# Altium project Mixed_Signal_Board_Project.PrjPcb (part 3 of 5)

## Sheet STM32F103 MCU.SchDoc
size A4; SheetNumber: 7; SheetTotal: 10
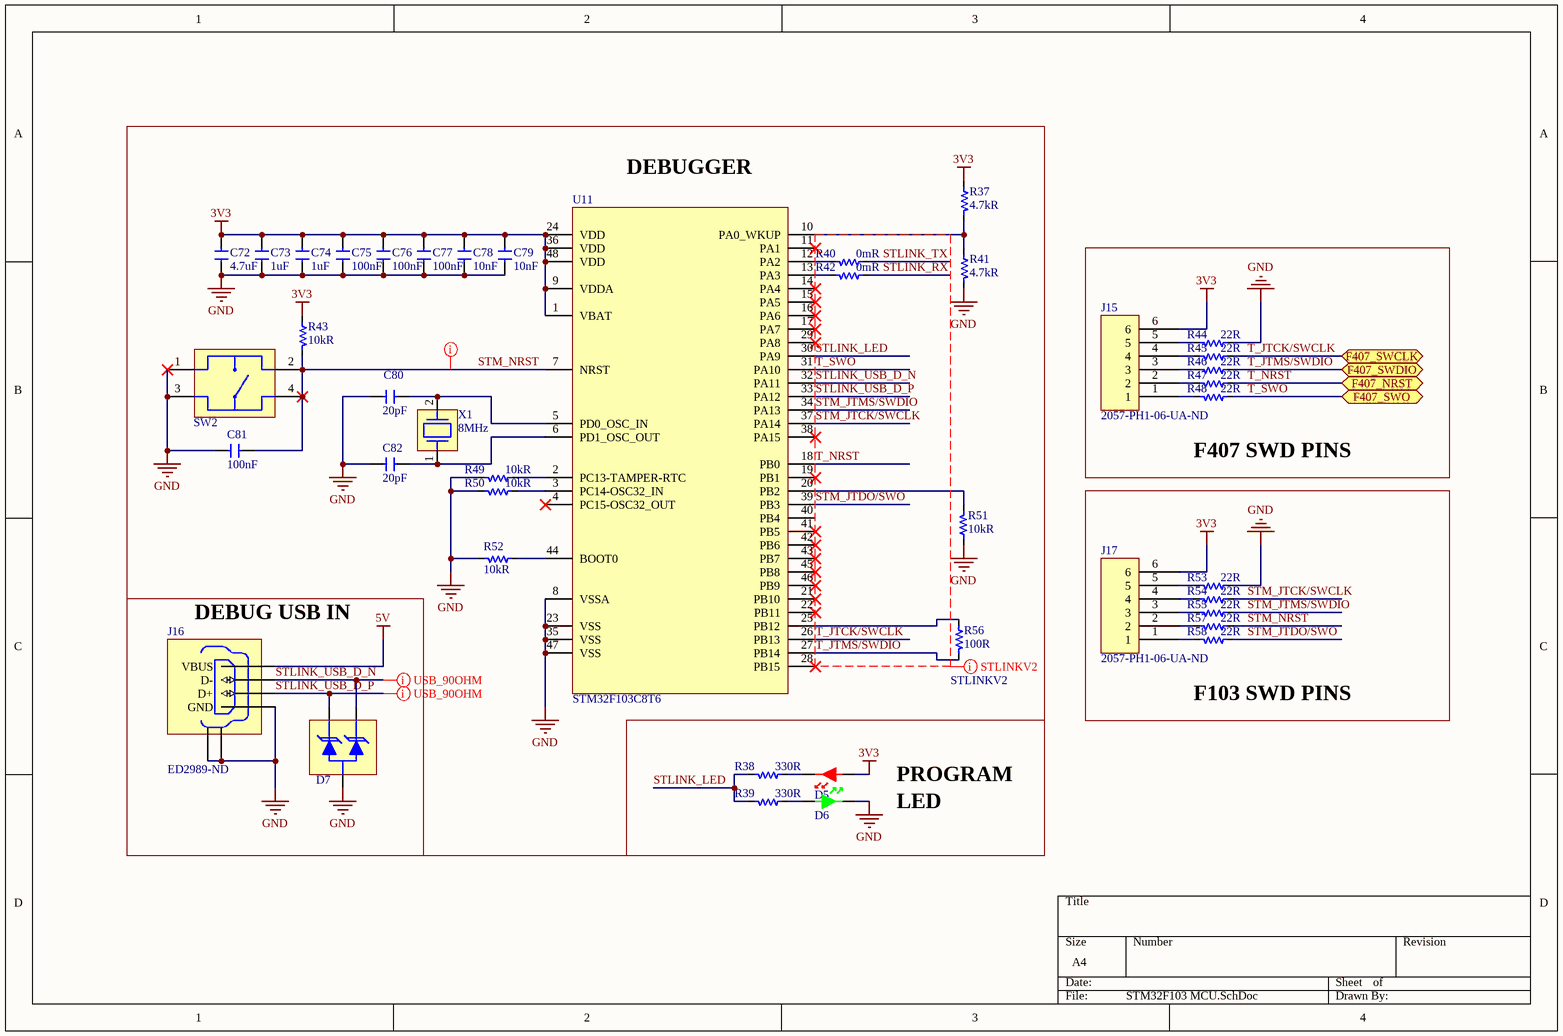
[diagram p6: STM32F103 MCU.SchDoc]

### Parts
C72  Capacitance: 4.7uF  [0805_CAP]  (hidden comment: CAP_4.7uF_%10_0805_25V_X7R_CER)
C73  1uF  [0805_CAP]
C74  1uF  [0805_CAP]
C75  Capacitance: 100nF  [0805_CAP]  (hidden comment: CAP_0.1uF_%20_50V_0805_X7R_CER)
C76  Capacitance: 100nF  [0805_CAP]  (hidden comment: CAP_0.1uF_%20_50V_0805_X7R_CER)
C77  Capacitance: 100nF  [0805_CAP]  (hidden comment: CAP_0.1uF_%20_50V_0805_X7R_CER)
C78  Capacitance: 10nF  [0805_CAP]  (hidden comment: CAP_10nF_%10_50V_0805_X7R_CER)
C79  Capacitance: 10nF  [0805_CAP]  (hidden comment: CAP_10nF_%10_50V_0805_X7R_CER)
C80  Capacitance: 20pF  [0805_CAP]  (hidden comment: CAP_20pF_5%_50V_0805_C0G/NP0_CER)
C81  Capacitance: 100nF  [0805_CAP]  (hidden comment: CAP_100nF_50V_0805_C0G_CER)
C82  Capacitance: 20pF  [0805_CAP]  (hidden comment: CAP_20pF_5%_50V_0805_C0G/NP0_CER)
D5  Red  [DIOC2114X07N-0805-LED-RED]  (value not drawn)
D6  Green  [DIOC2114X07N-0805-LED-GREEN]  (value not drawn)
D7  DIODE_TVS_3.3VWM_8VC_SOT23  [SOT170P237X110-3N]  (value not drawn)
J15  Supplier Part Number 1: 2057-PH1-06-UA-ND  [DIP_1X6_MALE_HEADER_2.54_PITCH]  (hidden comment: CONN_1X6_2.54m_Male Header)
J16  Supplier Part Number 1: ED2989-ND  [USB_2.0_B_OST_USB-A1HSW6]  (hidden comment: CONN_RCPT_USB-TYPE A_A1HSW6)
J17  Supplier Part Number 1: 2057-PH1-06-UA-ND  [DIP_1X6_MALE_HEADER_2.54_PITCH]  (hidden comment: CONN_1X6_2.54m_Male Header)
R37  Resistance: 4.7kR  [0805_RES]  (hidden comment: RES_4.7K OHM_5%_1/8W_0805)
R38  Resistance: 330R  [0805_RES]  (hidden comment: RES_330 OHM_5%_0805_1/8W)
R39  Resistance: 330R  [0805_RES]  (hidden comment: RES_330 OHM_5%_0805_1/8W)
R40  Resistance: 0mR  [0805_RES]  (hidden comment: RES_0 OHM_JUMPER_0805_1/8W)
R41  Resistance: 4.7kR  [0805_RES]  (hidden comment: RES_4.7K OHM_5%_1/8W_0805)
R42  Resistance: 0mR  [0805_RES]  (hidden comment: RES_0 OHM_JUMPER_0805_1/8W)
R43  Resistance: 10kR  [0805_RES]  (hidden comment: 10k Ohms)
R44  Resistance: 22R  [0805_RES]  (hidden comment: RES_22 OHM_1%_1/8W_0805)
R45  Resistance: 22R  [0805_RES]  (hidden comment: RES_22 OHM_1%_1/8W_0805)
R46  Resistance: 22R  [0805_RES]  (hidden comment: RES_22 OHM_1%_1/8W_0805)
R47  Resistance: 22R  [0805_RES]  (hidden comment: RES_22 OHM_1%_1/8W_0805)
R48  Resistance: 22R  [0805_RES]  (hidden comment: RES_22 OHM_1%_1/8W_0805)
R49  Resistance: 10kR  [0805_RES]  (hidden comment: 10k Ohms)
R50  Resistance: 10kR  [0805_RES]  (hidden comment: 10k Ohms)
R51  Resistance: 10kR  [0805_RES]  (hidden comment: 10k Ohms)
R52  Resistance: 10kR  [0805_RES]  (hidden comment: 10k Ohms)
R53  Resistance: 22R  [0805_RES]  (hidden comment: RES_22 OHM_1%_1/8W_0805)
R54  Resistance: 22R  [0805_RES]  (hidden comment: RES_22 OHM_1%_1/8W_0805)
R55  Resistance: 22R  [0805_RES]  (hidden comment: RES_22 OHM_1%_1/8W_0805)
R56  Resistance: 100R  [0805_RES]  (hidden comment: RES_100 OHM_1%_0805_1/8W)
R57  Resistance: 22R  [0805_RES]  (hidden comment: RES_22 OHM_1%_1/8W_0805)
R58  Resistance: 22R  [0805_RES]  (hidden comment: RES_22 OHM_1%_1/8W_0805)
SW2  SWITCH_TACTILE_SPST-NO_0.05A_12V  [TACT_SWITCH_6MMX6MM]  (value not drawn)
U11  STM32F103C8T6  [QFP50P900X900X160-48N]
X1  8MHz  [HC-49/US]

### Blocks framed on the sheet
F407 SWD PINS: J15 R44-R48
F103 SWD PINS: J17 R53-R55 R57 R58
DEBUG USB IN: D7 J16

### Ports
F407_NRST (bidir), F407_SWCLK (bidir), F407_SWDIO (bidir), F407_SWO (bidir)

### Nets
3V3: C72.2 C73.2 C74.2 C75.2 C76.2 C77.2 C78.2 C79.2 D5.2(ANODE) J15.6 J17.6 R37.2 R43.2 U11.1(VBAT) U11.9(VDDA) U11.24(VDD) U11.36(VDD) U11.48(VDD)
5V: J16.1(VBUS)
GND: C72.1 C73.1 C74.1 C75.1 C76.1 C77.1 C78.1 C79.1 C80.1 C81.2 C82.1 D6.1(CATHODE) D7.3(ANODE) J16.4(GND) J16.SH1(SHIELD) J16.SH2(SHIELD) R41.1 R44.2 R49.1 R50.1 R51.2 R52.1 R53.2 SW2.1 SW2.3 U11.8(VSSA) U11.23(VSS) U11.35(VSS) U11.47(VSS)
STLINK_LED: R38.1 R39.1 U11.30(PA9)
STLINK_RX: R42.2
STLINK_TX: R40.2
STLINK_USB_D_N: D7.1(CATHODE_1) J16.2(D-) U11.32(PA11)
STLINK_USB_D_P: D7.2(CATHODE_2) J16.3(D+) U11.33(PA12)
STM_JTCK/SWCLK: R54.2 U11.37(PA14)
STM_JTDO/SWO: R58.2 U11.39(PB3)
STM_JTMS/SWDIO: R55.2 U11.34(PA13)
STM_NRST: C81.1 R43.1 R57.2 SW2.2 SW2.4 U11.7(NRST)
T_JTCK/SWCLK: R45.2 U11.26(PB13) ; port F407_SWCLK
T_JTMS/SWDIO: R46.2 R56.1 U11.27(PB14) ; port F407_SWDIO
T_NRST: R47.2 U11.18(PB0) ; port F407_NRST
T_SWO: R48.2 U11.31(PA10) ; port F407_SWO
NetC80_2: C80.2 U11.5(PD0_OSC_IN) X1.2
NetC82_2: C82.2 U11.6(PD1_OSC_OUT) X1.1
NetD5_1: D5.1(CATHODE) R38.2
NetD6_2: D6.2(ANODE) R39.2
NetJ15_1: J15.1 R48.1
NetJ15_2: J15.2 R47.1
NetJ15_3: J15.3 R46.1
NetJ15_4: J15.4 R45.1
NetJ15_5: J15.5 R44.1
NetJ17_1: J17.1 R58.1
NetJ17_2: J17.2 R57.1
NetJ17_3: J17.3 R55.1
NetJ17_4: J17.4 R54.1
NetJ17_5: J17.5 R53.1
NetR37_1: R37.1 R41.2 U11.10(PA0_WKUP)
NetR40_1: R40.1 U11.12(PA2)
NetR42_1: R42.1 U11.13(PA3)
NetR49_2: R49.2 U11.2(PC13-TAMPER-RTC)
NetR50_2: R50.2 U11.3(PC14-OSC32_IN)
NetR51_1: R51.1 U11.20(PB2)
NetR52_2: R52.2 U11.44(BOOT0)
NetR56_2: R56.2 U11.25(PB12)

Not connected (* = marked no-connect by the designer): U11 4(PC15-OSC32_OUT)* 11(PA1)* 14(PA4)* 15(PA5)* 16(PA6)* 17(PA7)* 19(PB1)* 21(PB10)* 22(PB11)* 28(PB15)* 29(PA8)* 38(PA15)* 40(PB4) 41(PB5)* 42(PB6)* 43(PB7)* 45(PB8)* 46(PB9)*

### Layout directives
differential pair; differential pair class USB_90OHM: STLINK_USB_D_N, STLINK_USB_D_P
net class STLINKV2: STLINK_LED, STLINK_RX, STLINK_TX, STLINK_USB_D_N, STLINK_USB_D_P, STM_JTCK/SWCLK, STM_JTDO/SWO, STM_JTMS/SWDIO, STM_NRST, T_JTCK/SWCLK, T_JTMS/SWDIO, T_NRST, T_SWO

### Notes on the sheet
- DEBUGGER
- PROGRAM
- LED

### Library data of the parts
C72 = CAP_4.7uF_%10_0805_25V_X7R_CER: Cap 4.7UF 25VDC X7R 10% SMD 0805 Embossed Tape; Manufacturer: Murata; Manufacturer Part Number: GRM21BZ71E475KE15L; Supplier 1: Digi-Key; RoHS: Yes; Category: Ceramic Capacitors; Stock 1: 16381; Pricing 1: 1=0,35000, 10=0,24300, 50=0,16980, 100=0,14550, 500=0,10914, 1000=0,09217 (USD); RoHS Compliant: Yes; Supplier Part Number 1: 490-GRM21BZ71E475KE15LCT-ND
C73 C74 = CAP_1uF_%10_25V_0805_X7R_CER: 陶瓷电容 1uF(105) 1uF ±10% 25V 0805; Manufacturer: Samsung; Manufacturer Part Number: CL21B105KAFNNNG; Material: Ceramic; Dielectric: X7R; Supplier 1: Digi-Key; RoHS: Yes; Category: Ceramic Capacitors; Stock 1: 509034; Pricing 1: 1=0,10000, 10=0,07100, 50=0,03880, 100=0,03170, 500=0,02264, 1000=0,01779 (USD); Mount: Surface Mount; Case/Package: 0805; Case Code (Metric): 2012; Case Code (Imperial): 0805; Min Operating Temperature: -55°C; Max Operating Temperature: 125°C; Tolerance: 10%; Capacitance: 1uF; Voltage Rating: 25V; Package Quantity: 3000; Packaging: Tape and Reel; Voltage: 25V; Series: CL; Length: 2mm; Width: 0.049inch; Height: 1.25mm; Thickness: 0.053inch; Depth: 1.25mm; Radiation Hardening: No; RoHS Compliant: Yes; ComponentLink1URL: https://datasheet.ciiva.com/26920/getdatasheetpartid-698495-26920200.pdf?src-supplier=Verical; ComponentLink1Description: https://datasheet.ciiva.com/26920/getdatasheetpartid-698495-26920200.pdf?src-supplier=Verical; ComponentLink2URL: https://datasheet.ciiva.com/29199/455911-da-01-en-vs-kondensator-0805-29199043.pdf?src-supplier=Conrad; ComponentLink2Description: https://datasheet.ciiva.com/29199/455911-da-01-en-vs-kondensator-0805-29199043.pdf?src-supplier=Conrad; ComponentLink3URL: https://datasheet.ciiva.com/16428/cl05b104kq5nnnc-16428871.pdf?src-supplier=Future+Electronics; ComponentLink3Description: https://datasheet.ciiva.com/16428/cl05b104kq5nnnc-16428871.pdf?src-supplier=Future+Electronics; Supplier Part Number 1: 1276-6469-1-ND
C75-C77 = CAP_0.1uF_%20_50V_0805_X7R_CER: Cap Ceramic 0.1uF 50V X7R 20% SMD 0805 125C Paper T/R; Manufacturer: KEMET; Manufacturer Part Number: C0805C104M5RACTU; Supplier 1: Digi-Key; RoHS: Yes; Category: Ceramic Capacitors; Stock 1: 4863; Pricing 1: 1=0,10000, 10=0,06400, 50=0,03500, 100=0,02860, 500=0,02040, 1000=0,01603 (USD); Mount: Surface Mount; Case/Package: 0805; Dielectric Material: Ceramic; Min Operating Temperature: -55°C; Max Operating Temperature: 125°C; Tolerance: 20%; Dielectric: X7R; Packaging: Tape and Reel; Voltage Rating (DC): 50V; Length: 2mm; Height: 0.9mm; Depth: 1.25mm; Radiation Hardening: No; ComponentLink1URL: http://uk.rs-online.com/webdocs/13da/0900766b813daa06.pdf?src-supplier=RSComponents; ComponentLink1Description: http://uk.rs-online.com/webdocs/13da/0900766b813daa06.pdf?src-supplier=RSComponents; ComponentLink2URL: https://www.verical.com/server-webapp/html/getDatasheet?partID=774625&src-supplier=Verical; ComponentLink2Description: https://www.verical.com/server-webapp/html/getDatasheet?partID=774625&src-supplier=Verical; ComponentLink3URL: http://www.farnell.com/datasheets/2739857.pdf?src-supplier=Farnell; ComponentLink3Description: http://www.farnell.com/datasheets/2739857.pdf?src-supplier=Farnell; ComponentLink4URL: http://uk.rs-online.com/webdocs/1515/0900766b81515223.pdf?src-supplier=RSComponents; ComponentLink4Description: http://uk.rs-online.com/webdocs/1515/0900766b81515223.pdf?src-supplier=RSComponents; ComponentLink5URL: http://components.arrow.com/part/dataview/0323_00324812?src-supplier=Arrow+Europe; ComponentLink5Description: http://components.arrow.com/part/dataview/0323_00324812?src-supplier=Arrow+Europe; ComponentLink6URL: http://uk.rs-online.com/webdocs/1528/0900766b81528e2f.pdf?src-supplier=RSComponents; ComponentLink6Description: http://uk.rs-online.com/webdocs/1528/0900766b81528e2f.pdf?src-supplier=RSComponents; ComponentLink7URL: http://www.farnell.com/datasheets/2739857.pdf?src-supplier=Newark; ComponentLink7Description: http://www.farnell.com/datasheets/2739857.pdf?src-supplier=Newark; ComponentLink8URL: http://www.alliedelec.com/m/d/9bfe7773041ffe9d406e68bc7b377fdd.pdf?src-supplier=Allied+Electronics; ComponentLink8Description: http://www.alliedelec.com/m/d/9bfe7773041ffe9d406e68bc7b377fdd.pdf?src-supplier=Allied+Electronics; ComponentLink9URL: https://api.kemet.com/component-edge/download/datasheet/C0805C104M5RACTU.pdf?src-supplier=Digi-Key; ComponentLink9Description: https://api.kemet.com/component-edge/download/datasheet/C0805C104M5RACTU.pdf?src-supplier=Digi-Key; ComponentLink10URL: http://capacitoredge.kemet.com/capedge2/DataSheet?pn=C0805C104M5RACTU&src-supplier=Avnet+Europe; ComponentLink10Description: http://capacitoredge.kemet.com/capedge2/DataSheet?pn=C0805C104M5RACTU&src-supplier=Avnet+Europe; ComponentLink11URL: http://www.farnell.com/datasheets/2739857.pdf?src-supplier=Element14; ComponentLink11Description: http://www.farnell.com/datasheets/2739857.pdf?src-supplier=Element14; ComponentLink12URL: http://www.mouser.com/ds/2/212/KEM_C1002_X7R_SMD-1102033.pdf?src-supplier=Mouser; ComponentLink12Description: http://www.mouser.com/ds/2/212/KEM_C1002_X7R_SMD-1102033.pdf?src-supplier=Mouser; ComponentLink13URL: https://www.verical.com/server-webapp/html/getDatasheet?partID=91523&src-supplier=Verical; ComponentLink13Description: https://www.verical.com/server-webapp/html/getDatasheet?partID=91523&src-supplier=Verical; ComponentLink14URL: http://components.arrow.com/part/dataview/2091108S8109171N7429?src-supplier=Arrow+Electronics; ComponentLink14Description: http://components.arrow.com/part/dataview/2091108S8109171N7429?src-supplier=Arrow+Electronics; Supplier Part Number 1: 399-C0805C104M5RAC7800CT-ND
C78 C79 = CAP_10nF_%10_50V_0805_X7R_CER: CAP CER 10000PF 50V X7R 0805; Manufacturer: Samsung; Manufacturer Part Number: CL21B103KBANNNC; Material: Ceramic; Tolerance: 10%; Supplier 1: Digi-Key; RoHS: Yes; Category: Ceramic Capacitors; Stock 1: 1431273; Pricing 1: 1=0,10000, 10=0,04600, 50=0,02500, 100=0,02050, 500=0,01464, 1000=0,01150 (USD); Mount: Surface Mount; Case/Package: 0805; Case Code (Metric): 2012; Case Code (Imperial): 0805; Contact Plating: Tin; Min Operating Temperature: -55°C; Max Operating Temperature: 125°C; Dielectric: X7R; Voltage: 50V; Voltage Rating (DC): 50V; Packaging: Tape and Reel; Voltage Rating: 50V; Series: CL; Construction: Flat; Length: 2mm; Width: 0.049inch; Height: 0.65mm; Depth: 1.25mm; Thickness: 0.03inch; Radiation Hardening: No; Lead Free: Lead Free; RoHS Compliant: Yes; ComponentLink1URL: https://datasheet.ciiva.com/25709/cl21b103kbannnc-25709781.pdf?src-supplier=Digi-Key; ComponentLink1Description: https://datasheet.ciiva.com/25709/cl21b103kbannnc-25709781.pdf?src-supplier=Digi-Key; ComponentLink2URL: https://datasheet.ciiva.com/29199/455082-da-01-en-vs-kondensator-0805-29199459.pdf?src-supplier=Conrad; ComponentLink2Description: https://datasheet.ciiva.com/29199/455082-da-01-en-vs-kondensator-0805-29199459.pdf?src-supplier=Conrad; Supplier Part Number 1: 1276-1015-1-ND
C80 C82 = CAP_20pF_5%_50V_0805_C0G/NP0_CER: CAP CER 20PF 50V C0G/NP0 0805; Manufacturer: Samsung; Manufacturer Part Number: CL21C200JBANNNC; Tolerance: 5%; Dielectric: C0G; Temperature Coefficient: 300ppm/°C; Supplier 1: Digi-Key; RoHS: Yes; Category: Ceramic Capacitors; Stock 1: 11381; Pricing 1: 1=0,10000, 10=0,04700, 50=0,02540, 100=0,02080, 500=0,01484, 1000=0,01166 (USD); Mount: Surface Mount; Case/Package: 0805; Case Code (Metric): 2012; Case Code (Imperial): 0805; Min Operating Temperature: -55°C; Max Operating Temperature: 125°C; Voltage Rating: 50V; Package Quantity: 1; Packaging: Tape and Reel; Voltage: 50V; Series: CL; Construction: Flat; Length: 2mm; Width: 0.049inch; Height: 0.65mm; Thickness: 0.03inch; Depth: 1.25mm; Radiation Hardening: No; RoHS Compliant: Yes; ComponentLink1URL: https://datasheet.ciiva.com/16428/cl21c200jbannnc-16428913.pdf?src-supplier=Future+Electronics; ComponentLink1Description: https://datasheet.ciiva.com/16428/cl21c200jbannnc-16428913.pdf?src-supplier=Future+Electronics; Supplier Part Number 1: 1276-1829-1-ND
C81 = CAP_100nF_50V_0805_C0G_CER: Cap Ceramic 0.1uF 50V X7R 20% SMD 0805 125C Paper T/R; Manufacturer: KEMET; Manufacturer Part Number: C0805C104M5RACTU; Supplier 1: Digi-Key; RoHS: Yes; Category: Ceramic Capacitors; Stock 1: 4863; Pricing 1: 1=0,10000, 10=0,06400, 50=0,03500, 100=0,02860, 500=0,02040, 1000=0,01603 (USD); Mount: Surface Mount; Case/Package: 0805; Dielectric Material: Ceramic; Min Operating Temperature: -55°C; Max Operating Temperature: 125°C; Tolerance: 20%; Packaging: Tape and Reel; Dielectric: X7R; Voltage Rating (DC): 50V; Length: 2mm; Height: 0.9mm; Depth: 1.25mm; Radiation Hardening: No; ComponentLink1URL: http://uk.rs-online.com/webdocs/13da/0900766b813daa06.pdf?src-supplier=RSComponents; ComponentLink1Description: http://uk.rs-online.com/webdocs/13da/0900766b813daa06.pdf?src-supplier=RSComponents; ComponentLink2URL: http://uk.rs-online.com/webdocs/1515/0900766b81515223.pdf?src-supplier=RSComponents; ComponentLink2Description: http://uk.rs-online.com/webdocs/1515/0900766b81515223.pdf?src-supplier=RSComponents; ComponentLink3URL: http://www.farnell.com/datasheets/2739857.pdf?src-supplier=Farnell; ComponentLink3Description: http://www.farnell.com/datasheets/2739857.pdf?src-supplier=Farnell; ComponentLink4URL: http://components.arrow.com/part/dataview/0323_00324812?src-supplier=Arrow+Europe; ComponentLink4Description: http://components.arrow.com/part/dataview/0323_00324812?src-supplier=Arrow+Europe; ComponentLink5URL: http://uk.rs-online.com/webdocs/1528/0900766b81528e2f.pdf?src-supplier=RSComponents; ComponentLink5Description: http://uk.rs-online.com/webdocs/1528/0900766b81528e2f.pdf?src-supplier=RSComponents; ComponentLink6URL: http://www.farnell.com/datasheets/2739857.pdf?src-supplier=Newark; ComponentLink6Description: http://www.farnell.com/datasheets/2739857.pdf?src-supplier=Newark; ComponentLink7URL: https://api.kemet.com/component-edge/download/datasheet/C0805C104M5RACTU.pdf?src-supplier=Digi-Key; ComponentLink7Description: https://api.kemet.com/component-edge/download/datasheet/C0805C104M5RACTU.pdf?src-supplier=Digi-Key; ComponentLink8URL: http://www.farnell.com/datasheets/2739857.pdf?src-supplier=Element14; ComponentLink8Description: http://www.farnell.com/datasheets/2739857.pdf?src-supplier=Element14; ComponentLink9URL: http://www.alliedelec.com/m/d/9bfe7773041ffe9d406e68bc7b377fdd.pdf?src-supplier=Allied+Electronics; ComponentLink9Description: http://www.alliedelec.com/m/d/9bfe7773041ffe9d406e68bc7b377fdd.pdf?src-supplier=Allied+Electronics; ComponentLink10URL: http://www.mouser.com/ds/2/212/KEM_C1002_X7R_SMD-1102033.pdf?src-supplier=Mouser; ComponentLink10Description: http://www.mouser.com/ds/2/212/KEM_C1002_X7R_SMD-1102033.pdf?src-supplier=Mouser; ComponentLink11URL: http://capacitoredge.kemet.com/capedge2/DataSheet?pn=C0805C104M5RACTU&src-supplier=Avnet+Europe; ComponentLink11Description: http://capacitoredge.kemet.com/capedge2/DataSheet?pn=C0805C104M5RACTU&src-supplier=Avnet+Europe; Supplier Part Number 1: 399-C0805C104M5RAC7800CT-ND
D5 = LED_RED CLEAR_2SMD/0805: Led Red Clear 2SMD; Manufacturer: Everlight; Manufacturer Part Number: EAST2012RA1; Lens Color: Colorless; Luminous Intensity: 79mcd; Test Current: 20mA; Viewing Angle: 120°; Dominant Wavelength: 626nm; Forward Voltage: 2V; Supplier 1: Digi-Key; Category: LEDs; Stock 1: 154; Pricing 1: 1=0,23000, 10=0,12300, 100=0,05840, 500=0,04996, 1000=0,03842 (USD); Mount: Surface Mount; Case/Package: 0805; Color: Red; Packaging: Tape and Reel; Lens Transparency: Clear; Length: 2mm; Width: 1.25mm; Height: 1mm; RoHS Compliant: Yes; ComponentLink1URL: http://www.mouser.com/ds/2/143/EAST2012RA1-707412.pdf?src-supplier=Mouser; ComponentLink1Description: http://www.mouser.com/ds/2/143/EAST2012RA1-707412.pdf?src-supplier=Mouser; ComponentLink2URL: https://everlightamericas.com/index.php?controller=attachment&id_attachment=1047&src-supplier=Digi-Key; ComponentLink2Description: https://everlightamericas.com/index.php?controller=attachment&id_attachment=1047&src-supplier=Digi-Key; Supplier Part Number 1: 1080-EAST2012RA1CT-ND
D6 = LED_GREEN CLEAR_2SMD/0805: Led Green Clear 2SMD; Manufacturer: Everlight; Manufacturer Part Number: EAST2012GA5; Lens Color: Colorless; Luminous Intensity: 315mcd; Test Current: 20mA; Viewing Angle: 140°; Dominant Wavelength: 523nm; Forward Voltage: 3.4V; Supplier 1: Digi-Key; Category: LEDs; Stock 1: 15531; Pricing 1: 1=0,44000, 10=0,29000, 100=0,19380, 500=0,13406, 1000=0,11172 (USD); Mount: Surface Mount; Case/Package: 0805; Color: Green; Packaging: Tape and Reel; Lens Transparency: Clear; Length: 2mm; Width: 1.25mm; Height: 1mm; RoHS Compliant: Yes; ComponentLink1URL: http://www.mouser.com/ds/2/143/EAST2012GA5-707028.pdf?src-supplier=Mouser; ComponentLink1Description: http://www.mouser.com/ds/2/143/EAST2012GA5-707028.pdf?src-supplier=Mouser; ComponentLink2URL: https://everlightamericas.com/index.php?controller=attachment&id_attachment=1042&src-supplier=Digi-Key; ComponentLink2Description: https://everlightamericas.com/index.php?controller=attachment&id_attachment=1042&src-supplier=Digi-Key; Supplier Part Number 1: 1080-EAST2012GA5CT-ND
D7 = DIODE_TVS_3.3VWM_8VC_SOT23: ESD Suppressor TVS Uni-Dir 3.3V 3-Pin SOT-23 T/R; Manufacturer: MCC; Manufacturer Part Number: ESD3V3AP-TP; Number of Unidirectional Channels: 2; Min Breakdown Voltage: 5V; Clamping Voltage: 7.5V; Peak Pulse Current: 13.3A; Peak Pulse Power: 300W; Power Line Protection: No; Supplier 1: Digi-Key; RoHS: Yes; Category: TVS Diodes; Stock 1: 509; Pricing 1: 1=0,35000, 10=0,26400, 100=0,14950, 500=0,09900, 1000=0,07590 (USD); Mount: Surface Mount; Case/Package: TO-236-3; Min Operating Temperature: -55°C; Max Operating Temperature: 150°C; Resistor Type: Zener; Packaging: Tape and Reel; Reverse Standoff Voltage: 3.3V; RoHS Compliant: Yes; ComponentLink1URL: http://www.mccsemi.com/up_pdf/ESD3V3AP(SOT-23).pdf?src-supplier=Digi-Key; ComponentLink1Description: http://www.mccsemi.com/up_pdf/ESD3V3AP(SOT-23).pdf?src-supplier=Digi-Key; ComponentLink2URL: https://www.mccsemi.com/pdf/Products/ESD3V3AP(SOT-23).pdf?src-supplier=Digi-Key; ComponentLink2Description: https://www.mccsemi.com/pdf/Products/ESD3V3AP(SOT-23).pdf?src-supplier=Digi-Key; Supplier Part Number 1: ESD3V3AP-TPMSCT-ND
J15 J17 = CONN_1X6_2.54m_Male Header: PH Series 6 Position Through Hole Single Row Straight .100 Header; Manufacturer: Adam Equipment; Manufacturer Part Number: PH1-06-UA; Number of Positions: 6; Pitch: 2.54mm; Supplier 1: Digi-Key; RoHS: Yes; Category: Connectors; Stock 1: 1029; Pricing 1: 1=0,13000, 10=0,10000, 100=0,07370, 500=0,06098, 1000=0,05336, 5000=0,04574, 10000=0,04447 (USD); Mount: Through Hole; Contact Plating: Gold; Number of Contacts: 6; Packaging: Bag; Number of Rows: 1; Lead Free: Lead Free; ComponentLink1URL: http://www.adam-tech.com/catalog/2012/page_312-315.pdf?src-supplier=Future+Electronics; ComponentLink1Description: http://www.adam-tech.com/catalog/2012/page_312-315.pdf?src-supplier=Future+Electronics
J16 = CONN_RCPT_USB-TYPE A_A1HSW6: USB - A Receptacle Connector 4 Position Through Hole, Right Angle; MP: USB-A1HSW6; MF: {'manufacturer': u'On Shore'}; Package: None; Availability: Unavailable; Price: None; Value: *; Supplier 1: Digi-Key
R37 R41 = RES_4.7K OHM_5%_1/8W_0805: Res Thick Film 0805 4.7K Ohm 5% 1/8W ±200ppm/°C Molded SMD Paper T/R; Manufacturer: Vishay; Manufacturer Part Number: CRCW08054K70JNEAC; Power Rating: 125mW; Supplier 1: Digi-Key; RoHS: Yes; Category: Chip SMD Resistors; Stock 1: 36142; Pricing 1: 1=0,10000, 10=0,04000, 100=0,01630, 1000=0,00731, 2500=0,00635 (USD); Case/Package: 0805; Tolerance: 5%; Lead Free: Lead Free; RoHS Compliant: Yes; ComponentLink1URL: http://www.vishay.com/docs/28773/crcwce3.pdf?src-supplier=Digi-Key; ComponentLink1Description: http://www.vishay.com/docs/28773/crcwce3.pdf?src-supplier=Digi-Key; ComponentLink2URL: https://www.vishay.com/docs/28773/crcwce3.pdf?src-supplier=Digi-Key; ComponentLink2Description: https://www.vishay.com/docs/28773/crcwce3.pdf?src-supplier=Digi-Key; Supplier Part Number 1: 541-4165-1-ND
R38 R39 = RES_330 OHM_5%_0805_1/8W: Res Thick Film 0805 330 Ohm 5% 0.125W(1/8W) ±100ppm/C Pad SMD Automotive T/R; Manufacturer: TE Connectivity; Manufacturer Part Number: CRGCQ0805J330R; Supplier 1: Digi-Key; RoHS: Yes; Category: Chip SMD Resistors; Stock 1: 75221; Pricing 1: 1=0,10000, 10=0,04400, 100=0,01780, 1000=0,00798, 2500=0,00693 (USD); ComponentLink1URL: https://www.te.com/commerce/DocumentDelivery/DDEController?Action=srchrtrv&amp;DocNm=1773204-3&amp;DocType=DS&amp;DocLang=English&src-supplier=Digi-Key; ComponentLink1Description: https://www.te.com/commerce/DocumentDelivery/DDEController?Action=srchrtrv&amp;DocNm=1773204-3&amp;DocType=DS&amp;DocLang=English&src-supplier=Digi-Key; Supplier Part Number 1: A130131CT-ND
R40 R42 = RES_0 OHM_JUMPER_0805_1/8W: 贴片电阻 0Ω ±5% 1/8W 0805; Manufacturer: Yageo; Manufacturer Part Number: RC0805JR-070RL; Power Rating: 125mW; Voltage Rating: 150V; Temperature Coefficient: 200ppm/°C; Supplier 1: Digi-Key; RoHS: Yes; Category: Chip SMD Resistors; Stock 1: 2083007; Pricing 1: 1=0,10000, 10=0,03100, 25=0,02240, 50=0,01720, 100=0,01260, 250=0,00964, 500=0,00770, 1000=0,00567 (USD); Case/Package: 0805; Number of Pins: 2; Contact Plating: Tin,Matte; Case Code (Imperial): 0805; Case Code (Metric): 2012; Size Code: 0805; Min Operating Temperature: -55°C; Max Operating Temperature: 155°C; Resistor Type: Thick Film; Tolerance: 5%; Packaging: Tape and Reel; Voltage Rating (DC): 150V; Termination: SMD/SMT; Features: Moisture Resistant; Series: RC; Max Power Dissipation: 125mW; Number of Terminations: 2; Construction: Rectangular; Technology: THICK FILM; Resistance Tolerance: 5%; Length: 2mm; Width: 1.25mm; Height: 0.5mm; Depth: 1.25mm; Radiation Hardening: No; RoHS Compliant: Yes; REACH SVHC: Unknown; Military Standard: Not; Lead Free: Lead Free; ComponentLink1URL: https://datasheet.ciiva.com/11819/0900766b8106beab-11819430.pdf?src-supplier=RSComponents; ComponentLink1Description: https://datasheet.ciiva.com/11819/0900766b8106beab-11819430.pdf?src-supplier=RSComponents; ComponentLink2URL: https://datasheet.ciiva.com/7941/1738694-7941861.pdf?src-supplier=Element14; ComponentLink2Description: https://datasheet.ciiva.com/7941/1738694-7941861.pdf?src-supplier=Element14; ComponentLink3URL: https://datasheet.ciiva.com/7941/1738694-7941862.pdf?src-supplier=Element14; ComponentLink3Description: https://datasheet.ciiva.com/7941/1738694-7941862.pdf?src-supplier=Element14; ComponentLink4URL: https://datasheet.ciiva.com/7941/1738694-7941863.pdf?src-supplier=Element14; ComponentLink4Description: https://datasheet.ciiva.com/7941/1738694-7941863.pdf?src-supplier=Element14; ComponentLink5URL: https://datasheet.ciiva.com/15190/getdatasheetpartid-330685-15190028.pdf?src-supplier=Verical; ComponentLink5Description: https://datasheet.ciiva.com/15190/getdatasheetpartid-330685-15190028.pdf?src-supplier=Verical; Supplier Part Number 1: 311-0.0ARCT-ND
R43 R49-R52 = RES_10K OHM_%1_0805_1/8W: Res SMD 0805 10K 1% 0.125W T.C.100PPM; Manufacturer: TDK; Manufacturer Part Number: C2012X7R1H104K085AA; Dielectric Material: Ceramic; Capacitance: 100nF; Tolerance: 10%; Dielectric: X7R; Voltage Rating: 50V; Temperature Coefficient: 100ppm/°C; Power Rating: 125mW; Supplier 1: Digi-Key; RoHS: Yes; Category: Ceramic Capacitors; Stock 1: 54853; Pricing 1: 1=0,15000, 10=0,10900, 50=0,06160, 100=0,05100, 500=0,03578, 1000=0,02962 (USD); Mount: Surface Mount; Case/Package: 0805; Number of Pins: 2; Case Code (Metric): 2012; Case Code (Imperial): 0805; Weight: 0.000194oz; Min Operating Temperature: -55°C; Max Operating Temperature: 125°C; Packaging: Tape and Reel; Voltage Rating (DC): 50V; Termination: SMD/SMT; Construction: Flat; Package Quantity: 1; Resistor Type: Ceramic; Voltage: 50V; Series: C; Length: 2mm; Width: 0.049inch; Height: 0.85mm; Depth: 1.25mm; Thickness: 0.037inch; Radiation Hardening: No; RoHS Compliant: Yes; REACH SVHC: No SVHC; Lead Free: Lead Free; ComponentLink1URL: https://datasheet.ciiva.com/11788/0900766b80c1bb00-11788128.pdf?src-supplier=RSComponents; ComponentLink1Description: https://datasheet.ciiva.com/11788/0900766b80c1bb00-11788128.pdf?src-supplier=RSComponents; ComponentLink2URL: https://datasheet.ciiva.com/6250/tdkmlcccaprange-6250821.pdf?src-supplier=Digi-Key; ComponentLink2Description: https://datasheet.ciiva.com/6250/tdkmlcccaprange-6250821.pdf?src-supplier=Digi-Key; ComponentLink3URL: https://datasheet.ciiva.com/24191/e412-c-24191447.pdf?src-supplier=Future+Electronics; ComponentLink3Description: https://datasheet.ciiva.com/24191/e412-c-24191447.pdf?src-supplier=Future+Electronics; ComponentLink4URL: https://datasheet.ciiva.com/6250/tdkmlcccaprange-6250824.pdf?src-supplier=Digi-Key; ComponentLink4Description: https://datasheet.ciiva.com/6250/tdkmlcccaprange-6250824.pdf?src-supplier=Digi-Key; ComponentLink5URL: https://datasheet.ciiva.com/23803/1796654-23803035.pdf?src-supplier=Newark; ComponentLink5Description: https://datasheet.ciiva.com/23803/1796654-23803035.pdf?src-supplier=Newark; ComponentLink6URL: https://datasheet.ciiva.com/28602/1571323-28602204.pdf?src-supplier=Element14; ComponentLink6Description: https://datasheet.ciiva.com/28602/1571323-28602204.pdf?src-supplier=Element14; Supplier Part Number 1: 445-7534-1-ND; Supplier 2: Digi-Key; Stock 2: 3512962; Pricing 2: 1=0,10000, 10=0,04200, 100=0,01690, 1000=0,00759, 2500=0,00659 (USD); Size Code: 0805; Number of Terminations: 2; Max Power Dissipation: 125mW; Features: Moisture Resistant; Resistance Tolerance: 1%; Technology: THICK FILM; Military Standard: Not; Supplier Part Number 2: 311-10.0KCRCT-ND
R44-R48 R53-R55 R57 R58 = RES_22 OHM_1%_1/8W_0805: Res Thick Film 0805 22 Ohm 1% 0.125W(1/8W) ±100ppm/C Pad SMD T/R; Manufacturer: Vishay Dale; Manufacturer Part Number: CRCW080522R0FKEAC; Max Power Dissipation: 125mW; Temperature Coefficient: 100ppm/°C; Supplier 1: Digi-Key; RoHS: Yes; Stock 1: 199510; Pricing 1: 1=0,10000, 10=0,06300, 100=0,02540, 1000=0,01143, 2500=0,00992 (USD); Case/Package: 0805; Case Code (Imperial): 0805; Case Code (Metric): 2012; Min Operating Temperature: -55°C; Max Operating Temperature: 155°C; Resistor Type: Thick Film; Packaging: Tape and Reel; Tolerance: 1%; Number of Terminations: 2; RoHS Compliant: Yes; ComponentLink1URL: http://www.vishay.com/docs/28773/crcwce3.pdf?src-supplier=Digi-Key; ComponentLink1Description: http://www.vishay.com/docs/28773/crcwce3.pdf?src-supplier=Digi-Key; Supplier Part Number 1: 541-4151-1-ND
R56 = RES_100 OHM_1%_0805_1/8W: 贴片电阻 100Ω ± 1.00% 0.125W ± 100ppm/℃ 0805; Manufacturer: Yageo; Manufacturer Part Number: RC0805FR-07100RL; Power Rating: 125mW; Tolerance: 1%; Voltage Rating: 150V; Temperature Coefficient: 100ppm/°C; Application(s): HIGH RELIABILITY; Supplier 1: Digi-Key; RoHS: Yes; Category: Chip SMD Resistors; Stock 1: 3418646; Pricing 1: 1=0,10000, 10=0,04200, 100=0,01690, 1000=0,00759, 2500=0,00659 (USD); Case/Package: 0805; Number of Pins: 2; Case Code (Imperial): 0805; Case Code (Metric): 2012; Weight: 0.000917oz; Min Operating Temperature: -55°C; Max Operating Temperature: 155°C; Packaging: Cut Tape; Package Quantity: 5000; Termination: SMD/SMT; Resistor Type: Thick Film; Number of Terminations: 2; Max Power Dissipation: 125mW; Features: Moisture Resistant; Series: RC; Technology: THICK FILM; Voltage Rating (DC): 150V; Type: General Purpose; Length: 2mm; Width: 1.25mm; Height: 0.5mm; Depth: 1.25mm; Lead Pitch: 0.4mm; REACH SVHC: Unknown; Lead Free: Lead Free; RoHS Compliant: Yes; Military Standard: Not; ComponentLink1URL: https://datasheet.ciiva.com/11808/0900766b8106beab-11808877.pdf?src-supplier=RSComponents; ComponentLink1Description: https://datasheet.ciiva.com/11808/0900766b8106beab-11808877.pdf?src-supplier=RSComponents; ComponentLink2URL: https://datasheet.ciiva.com/7941/1697719-7941680.pdf?src-supplier=Element14; ComponentLink2Description: https://datasheet.ciiva.com/7941/1697719-7941680.pdf?src-supplier=Element14; ComponentLink3URL: https://datasheet.ciiva.com/7660/38627-7660797.pdf?src-supplier=Element14; ComponentLink3Description: https://datasheet.ciiva.com/7660/38627-7660797.pdf?src-supplier=Element14; ComponentLink4URL: https://datasheet.ciiva.com/2456/pyu-r-int-thick-7-2456987.pdf?src-supplier=Digi-Key; ComponentLink4Description: https://datasheet.ciiva.com/2456/pyu-r-int-thick-7-2456987.pdf?src-supplier=Digi-Key; Supplier Part Number 1: 311-100CRCT-ND
SW2 = SWITCH_TACTILE_SPST-NO_0.05A_12V: Switch Tactile N.O. SPST Round Button Gull Wing 0.05A 12VDC 100000Cycles 1.27N SMD T/R; Manufacturer: ITT C&K; Manufacturer Part Number: PTS645SL43SMTR92LFS; Actuator Material: Nylon,Polyamide,PA66; Max Voltage Rating (DC): 12V; Contact Resistance: 100mR; Max Current Rating: 50mA; Illumination Type: Non-Illuminated; Switch Function: Off-Mom; Actuator Type: Standard; Actuator Length: 0.85mm; Supplier 1: Digi-Key; RoHS: Yes; Category: Tactile Switches; Stock 1: 52166; Pricing 1: 1=0,15000, 10=0,14900, 25=0,14160, 100=0,12870, 250=0,12104, 500=0,11072 (USD); Mount: Surface Mount; Contact Material: Bronze,Brass,Silver; Contact Plating: Silver; Mechanical Life: 100000Cycles; Color: Black; Min Operating Temperature: -20°C; Max Operating Temperature: 60°C; Throw Configuration: SPST; Operating Force: 1.27N; Packaging: Tape and Reel; Termination: Gull Wing; Voltage Rating (DC): 12V; Package Quantity: 1000; Current Rating: 50mA; Orientation: Straight; Series: PTS645; Length: 6mm; Depth: 9mm; Size: 6mm; Lead Free: Lead Free; RoHS Compliant: Yes; ComponentLink1URL: https://datasheet.ciiva.com/26927/getdatasheetpartid-774114-26927132.pdf?src-supplier=Verical; ComponentLink1Description: https://datasheet.ciiva.com/26927/getdatasheetpartid-774114-26927132.pdf?src-supplier=Verical; Supplier Part Number 1: CKN10880CT-ND
U11 = IC_MCU_STM32F103C8T6: IC MCU 32BIT 64KB FLASH 48LQFP; Manufacturer: STMicroelectronics; RAM Size: 20KB; Frequency: 72MHz; Max Power Dissipation: 363mW; Interface: I2C,SPI,USB,CAN,USART; Number of I/Os: 37; Number of Timers/Counters: 3; Max Supply Voltage: 3.6V; Number of ADC Channels: 10; Min Supply Voltage: 2V; Oscillator Type: Internal; Number of Programmable I/O: 48; Data Bus Width: 32b; Number of Bits: 32; Watchdog Timer: Yes; Peripherals: POR,PWM,WDT,DMA,Temp Sensor,I2C; Core Architecture: ARM; Number of PWM Channels: 1; Number of SPI Channels: 2; Supplier 1: Digi-Key; Manufacturer Part Number: STM32F103C8T6; RoHS: Yes; Category: Microcontrollers; Pricing 1: 1=7,26000, 10=6,56100, 25=6,25560, 80=5,43163, 250=5,18752, 500=5,08580 (USD); Case/Package: LQFP; Number of Pins: 48; Weight: 0.006349oz; Min Operating Temperature: -40°C; Max Operating Temperature: 85°C; Packaging: Tray; Package Quantity: 1500; Density: 64KB; Memory Type: FLASH; Max Frequency: 72MHz; Memory Size: 64KB; Series: STM32F103C8; Termination: SMD/SMT; Number of I2C Channels: 2; Address Bus Width: 32b; Length: 7mm; Width: 7mm; Height: 1.4mm; Radiation Hardening: No; Lead Free: Lead Free; REACH SVHC: No SVHC; RoHS Compliant: Yes; ComponentLink1URL: https://datasheet.ciiva.com/15122/getdatasheetpartid-69880-15122076.pdf?src-supplier=Verical; ComponentLink1Description: https://datasheet.ciiva.com/15122/getdatasheetpartid-69880-15122076.pdf?src-supplier=Verical; ComponentLink2URL: https://datasheet.ciiva.com/8054/1730126-8054942.pdf?src-supplier=Element14; ComponentLink2Description: https://datasheet.ciiva.com/8054/1730126-8054942.pdf?src-supplier=Element14; ComponentLink3URL: https://datasheet.ciiva.com/14100/pustm-arm-microcont-stm32f103-en-14100508.pdf?src-supplier=Distrelec; ComponentLink3Description: https://datasheet.ciiva.com/14100/pustm-arm-microcont-stm32f103-en-14100508.pdf?src-supplier=Distrelec; ComponentLink4URL: https://datasheet.ciiva.com/16210/cd00161566-16210248.pdf?src-supplier=Future+Electronics; ComponentLink4Description: https://datasheet.ciiva.com/16210/cd00161566-16210248.pdf?src-supplier=Future+Electronics; ComponentLink5URL: https://datasheet.ciiva.com/48687/001075658-da-01-en-mcu-64kb-mem-stm32f103c8t6-lqfp-48-stm-48687589.pdf?src-supplier=Conrad; ComponentLink5Description: https://datasheet.ciiva.com/48687/001075658-da-01-en-mcu-64kb-mem-stm32f103c8t6-lqfp-48-stm-48687589.pdf?src-supplier=Conrad; Supplier Part Number 1: 497-6063-ND
X1 = CRYSTAL_8.0000MHZ_16PF_SMD: Crystal 8.0000MHZ 16PF SMD; Manufacturer: Raltron Electronics; Manufacturer Part Number: AS-8.000-16-SMD-TR; Supplier 1: Digi-Key; RoHS: No; Category: Uncategorized; Pricing 1: 1000=0,06400, 3000=0,06000, 5000=0,05800, 10000=0,05600 (USD); Supplier Part Number 1: 2151-AS-8.000-16-SMD-TR-ND